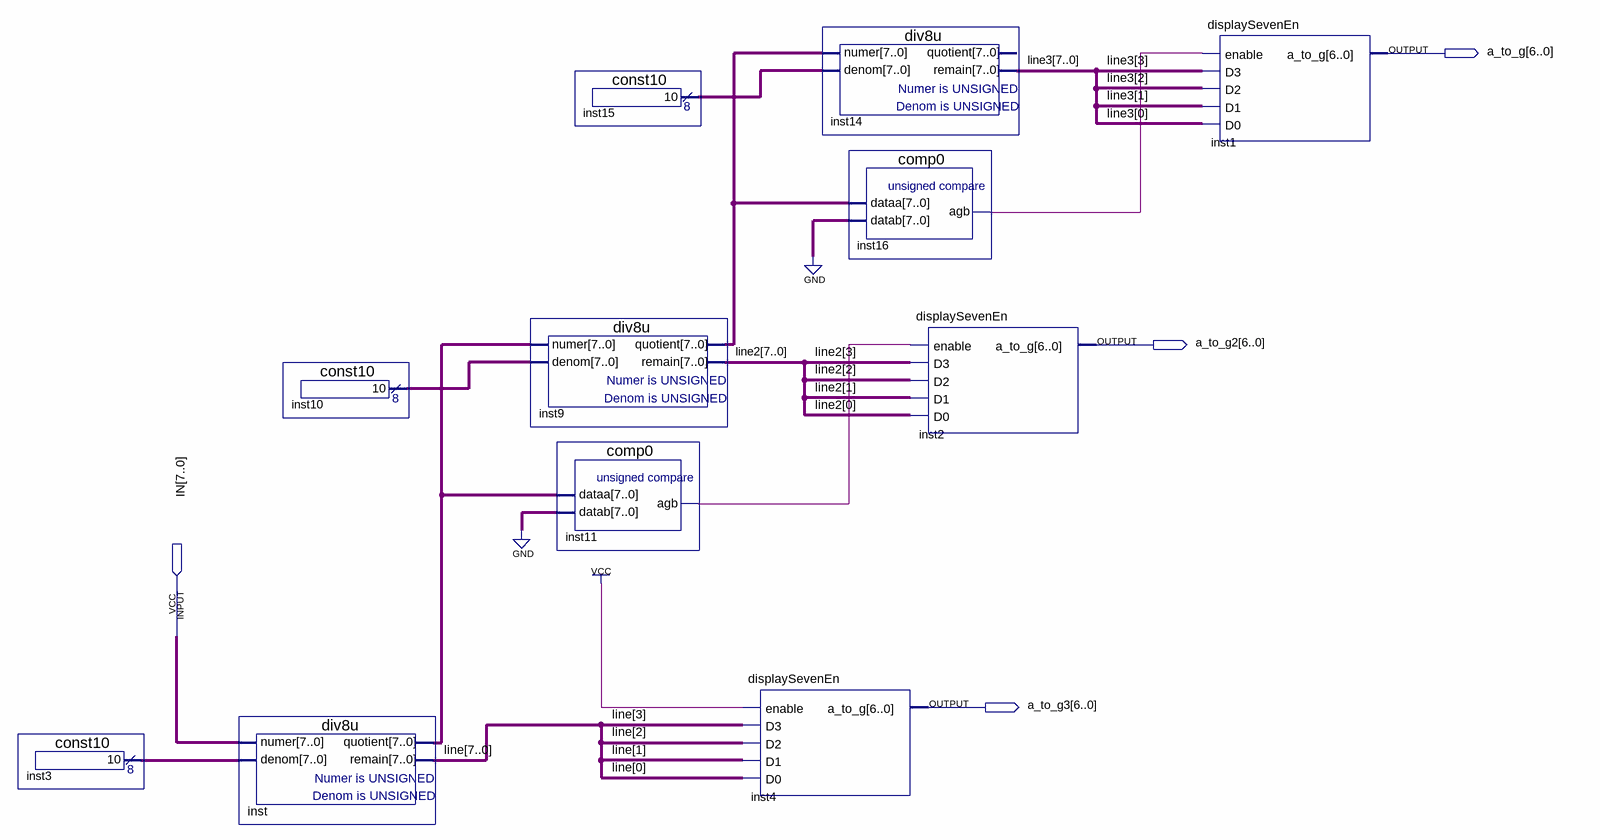
[diagram p0: schematic sheet]
// Quartus schematic display_8bits.bdf as structural Verilog: 11 symbols, 4 pins
module display_8bits (
  input  [7:0] IN,
  output [6:0] a_to_g,
  output [6:0] a_to_g2,
  output [6:0] a_to_g3
);

  wire inst11_agb, inst16_agb;
  wire [7:0] inst3_result, inst9_quotient, inst10_result, inst15_result, inst_quotient, line, line2, line3;

  const10 inst3 (.result(inst3_result));
  div8u inst (.numer(IN), .denom(inst3_result), .quotient(inst_quotient), .remain(line));
  const10 inst10 (.result(inst10_result));
  const10 inst15 (.result(inst15_result));
  div8u inst9 (.numer(inst_quotient), .denom(inst10_result), .quotient(inst9_quotient), .remain(line2));
  comp0 inst11 (.dataa(inst_quotient), .datab({8{1'b0}}), .agb(inst11_agb));
  displaySevenEn inst4 (.enable(1'b1), .D3(line[3]), .D2(line[2]), .D1(line[1]), .D0(line[0]), .a_to_g(a_to_g3));
  div8u inst14 (.numer(inst9_quotient), .denom(inst15_result), .remain(line3));  // open: quotient
  comp0 inst16 (.dataa(inst9_quotient), .datab({8{1'b0}}), .agb(inst16_agb));
  displaySevenEn inst2 (
    .enable(inst11_agb), .D3(line2[3]), .D2(line2[2]), .D1(line2[1]), .D0(line2[0]), .a_to_g(a_to_g2));
  displaySevenEn inst1 (
    .enable(inst16_agb), .D3(line3[3]), .D2(line3[2]), .D1(line3[1]), .D0(line3[0]), .a_to_g(a_to_g));
endmodule
